# EasyEDA schematic SCH_Geiger.json
TITLE: PSU and detector; REV: 1.0; Date: 2020-01-05; Sheet: 1/1; Drawn By: M.daSilva; Company: N/A
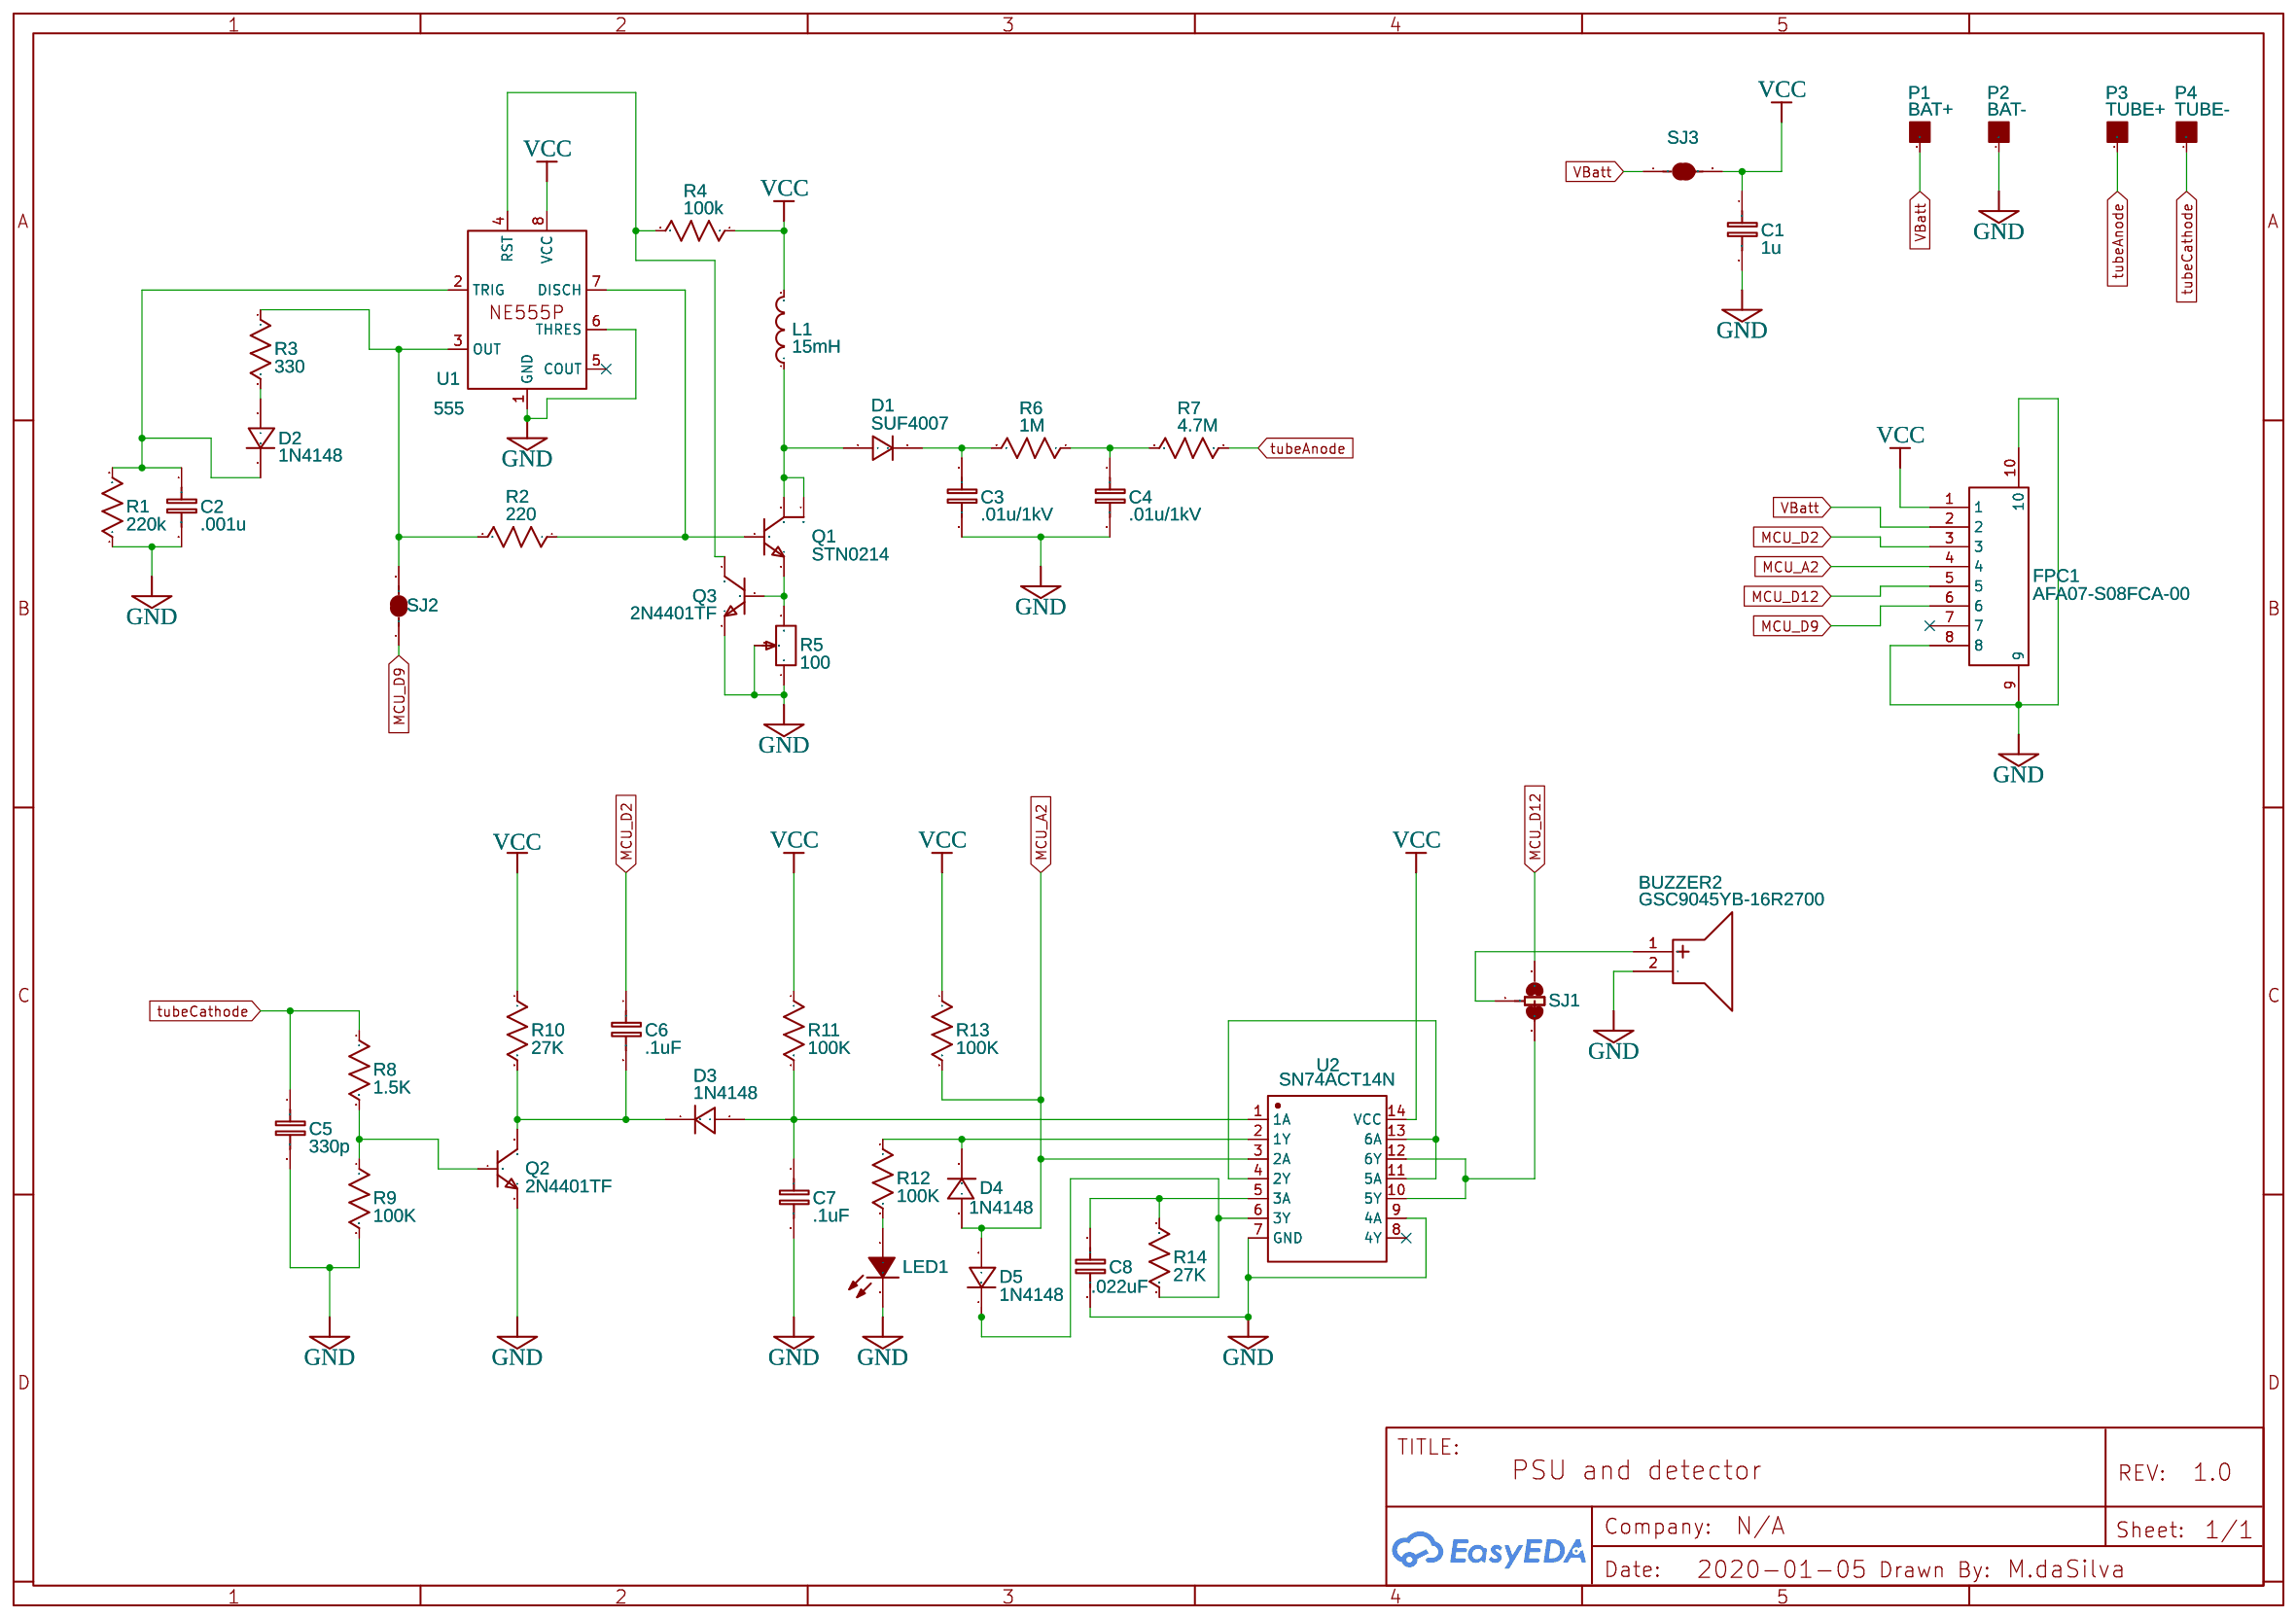
[diagram p0: schematic sheet]

## Parts
BUZZER2  GSC9045YB-16R2700  [BUZ-SMD_GSC9045YB-16R2700]
C1  1u  [C0805]
C2  .001u  [C0805]
C3  .01u/1kV  [C1210]
C4  .01u/1kV  [C1210]
C5  330p  [C0805]
C6  .1uF  [C0805]
C7  .1uF  [C0805]
C8  .022uF  [C0805]
D1  SUF4007  [DO-213AB_L5.0-W2.5-RD]
D2  1N4148  [SOD-123_L2.8-W1.8-LS3.7-RD]
D3  1N4148  [SOD-123_L2.8-W1.8-LS3.7-RD]
D4  1N4148  [SOD-123_L2.8-W1.8-LS3.7-RD]
D5  1N4148  [SOD-123_L2.8-W1.8-LS3.7-RD]
FPC1  AFA07-S08FCA-00  [FPC-SMD_8P-P1.00_LCS-XJ]
L1  15mH  [IND-SMD_L6.0-W6.0_FNR60XXS]
LED1  17-215/T7D-JU1V1E/3T  [LED0805-R-RD]
P1  BAT+  [3MMPAD]
P2  BAT-  [3MMPAD]
P3  TUBE+  [3MMPAD]
P4  TUBE-  [3MMPAD]
Q1  STN0214  [SOT-223-3_L6.5-W3.4-P2.30-LS7.0-BR]
Q2  2N4401TF  [SOT-23-3_L2.9-W1.3-P1.90-LS2.4-BR]
Q3  2N4401TF  [SOT-23-3_L2.9-W1.3-P1.90-LS2.4-BR]
R1  220k  [R0805]
R2  220  [R0805]
R3  330  [R0805]
R4  100k  [R0805]
R5  100  [RES-ADJ-SMD_VG039NCH]
R6  1M  [R0805]
R7  4.7M  [R0805]
R8  1.5K  [R0805]
R9  100K  [R0805]
R10  27K  [R0805]
R11  100K  [R0805]
R12  100K  [R0805]
R13  100K  [R0805]
R14  27K  [R0805]
SJ1  JUMPER-PAD-3-2OF3_NC_BY_TRACE_LARGE  [PAD-JUMPER-3-2OF3_NC_BY_TRACE_YES_SILK_LARGE]
SJ2  JUMPER-PAD-2-NOYES_SILK  [PAD-JUMPER-2-NO_YES_SILK]
SJ3  JUMPER-PAD-2-NC_BY_TRACE  [PAD-JUMPER-2-NC_BY_TRACE_YES_SILK]
U1  555  [SOIC-8_L4.9-W3.9-P1.27-LS6.0-BL]
U2  SN74ACT14N  [SOIC-14_L10.0-W5.5-P1.27-LS7.8-BL]

## Library data of the parts
BUZZER2 = GSC9045YB-16R2700: Supplier: LCSC; Supplier Part: C255324; Manufacturer: INGHAi; Contributor: LCSC
C1 = Cap_RAD-0.1_EU: Manufacturer Part: 0805B105K500AT
C2 C6 = Cap_RAD-0.1_EU: Manufacturer Part: 0805B102J500NT
C3 C4 = Cap_RAD-0.1_EU: Manufacturer Part: 1210B103K102NT; Supplier: LCSC; Supplier Part: C225089
C5 = Cap_RAD-0.1_EU: Manufacturer Part: 0805B331K101NT
C7 = Cap_RAD-0.1_EU: Manufacturer Part: 0805B104J500NT
C8 = Cap_RAD-0.1_EU: Manufacturer Part: CC0805KRX7R9BB223
D1 = SUF4007: Supplier: LCSC; Supplier Part: C212757; Manufacturer: (DIOTEC); Contributor: LCSC
D2-D5 = 1N4148W_C402213: Supplier: LCSC; Supplier Part: C402213; Manufacturer: LGE; Manufacturer Part: 1N4148W; Contributor: LCSC
FPC1 = AFA07-S08FCA-00: Supplier: LCSC; Supplier Part: C262714; Manufacturer: JUSHUO; Contributor: LCSC
L1 = FNR6045S153KT: Supplier: LCSC; Manufacturer: cjiang; Contributor: LCSC; Supplier Part: C168110
LED1 = 17-215/T7D-JU1V1E/3T: Supplier: LCSC; Supplier Part: C264428; Manufacturer: Everlight Elec; Contributor: LCSC
P1-P4 = 3MMPAD: catid: 20; Contributor: EasyEDA
Q1 = STN851: Supplier: LCSC; Manufacturer: STMicroelectronics; Contributor: LCSC; LCSC Assembly: Yes; SMT Type: Extend
Q2 Q3 = 2N4401TF: Supplier: LCSC; Supplier Part: C83940; Manufacturer: ON Semicon; Contributor: LCSC
R1 = Res_AXIAL-0.3(1/8W)_US: Manufacturer Part: RTT052203FTP
R2 = Res_AXIAL-0.3(1/8W)_US: Manufacturer Part: RTT052200FTP
R3 = Res_AXIAL-0.3(1/8W)_US: Manufacturer Part: RTT053300FTP
R4 R9 R11-R13 = Res_AXIAL-0.3(1/8W)_US: Manufacturer Part: RTT051003FTP
R5 = VG039NCHXTB101: Supplier: LCSC; Manufacturer: HDK; Supplier Part: C128542
R6 = Res_AXIAL-0.3(1/8W)_US: Manufacturer Part: RTT051004FTP
R7 = Res_AXIAL-0.3(1/8W)_US: Manufacturer Part: RTT054704FTP
R8 = Res_AXIAL-0.3(1/8W)_US: Manufacturer Part: RTT051501FTP
R10 R14 = Res_AXIAL-0.3(1/8W)_US: Manufacturer Part: RTT052702FTP
SJ1 = JUMPER-PAD-3-2OF3_NC_BY_TRACE_LARGE: Contributor: SparkFun
SJ2 = JUMPER-PAD-2-NOYES_SILK: Contributor: SparkFun
SJ3 = JUMPER-PAD-2-NC_BY_TRACE: Contributor: SparkFun
U1 = NE555P: Supplier: LCSC; Manufacturer: TI; Manufacturer Part: TLC555IDR; image: //image.lceda.cn/szlcsc/C46749.jpg; Supplier Part: C6987
U2 = SN74ACT14N: Manufacturer Part: MC74ACT14DR2G; Supplier Part: C7316; Supplier: LCSC

## Nets
GND: BUZZER2.2(-) C1.2 C2.2 C3.2 C4.2 C5.2 C7.2 C8.2 FPC1.8 FPC1.9 FPC1.10 LED1.2(K) P2.1 Q2.2(E) Q3.2(E) R1.1 R5.1 R5.2 R9.2 U1.1(GND) U1.6(THRES) U2.7(GND) U2.9(4A)
VBatt: FPC1.2 P1.1 SJ3.1
VCC: C1.1 FPC1.1 L1.2 R4.1 R10.1 R11.1 R13.1 SJ3.2 U1.8(VCC) U2.14(VCC)
MCU_A2: D4.2(A) D5.2(A) FPC1.4 R13.2 U2.3(2A)
MCU_D2: C6.1 FPC1.3
MCU_D9: FPC1.6 SJ2.1
MCU_D12: FPC1.5 SJ1.1
tubeAnode: P3.1 R7.1
tubeCathode: C5.1 P4.1 R8.1
Net-(BUZZER2-1): BUZZER2.1(+) SJ1.2
Net-(C2-1): C2.1 D2.1(C) R1.2 U1.2(TRIG)
Net-(C3-1): C3.1 D1.1(A) R6.2
Net-(C4-1): C4.1 R6.1 R7.2
Net-(C6-2): C6.2 D3.1(C) Q2.3(C) R10.2
Net-(C7-1): C7.1 D3.2(A) R11.2 U2.1(1A)
Net-(C8-1): C8.1 R14.1 U2.5(3A)
Net-(D1-2): D1.2(K) L1.1 Q1.2(C) Q1.4(C)
Net-(D2-2): D2.2(A) R3.2
Net-(D4-1): D4.1(C) R12.1 U2.2(1Y)
Net-(D5-1): D5.1(C) R14.2 U2.6(3Y)
Net-(LED1-1): LED1.1(A) R12.2
Net-(Q1-1): Q1.1(B) R2.1 U1.7(DISCH)
Net-(Q1-3): Q1.3(E) Q3.1(B) R5.3
Net-(Q2-1): Q2.1(B) R8.2 R9.1
Net-(Q3-3): Q3.3(C) R4.2 U1.4(RST)
Net-(R2-2): R2.2 R3.1 SJ2.2 U1.3(OUT)
Net-(SJ1-3): SJ1.3 U2.10(5Y) U2.12(6Y)
Net-(U2-4): U2.4(2Y) U2.11(5A) U2.13(6A)

Not connected (* = marked no-connect by the designer): FPC1 7*; U1 5(COUT)*; U2 8(4Y)*
